# EAGLE design NE555SingleTimer (EAGLE 9.6.2)
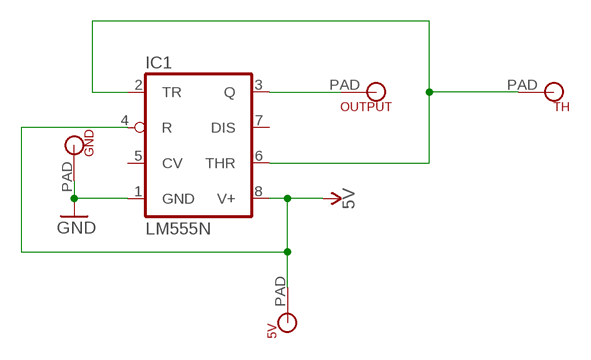
[diagram p0: schematic, sheet 1]

## Parts
5V  MICROBIT_PAD  [MICROBIT_PAD]
GND  MICROBIT_PAD  [MICROBIT_PAD]
IC1  LM555N  [DIL08]
OUTPUT  MICROBIT_PAD  [MICROBIT_PAD]
TH  MICROBIT_PAD  [MICROBIT_PAD]

## Nets
5V: 5V.PAD IC1.4(R) IC1.8(V+)
GND: GND.PAD IC1.1(GND)
N$1: IC1.3(Q) OUTPUT.PAD
N$2: IC1.2(TR) IC1.6(THR) TH.PAD
Unconnected: IC1.5(CV) IC1.7(DIS)

## Library data of the parts
5V GND OUTPUT TH = microbit:MICROBIT_PAD
IC1 = linear:*555: TIMER

## Board
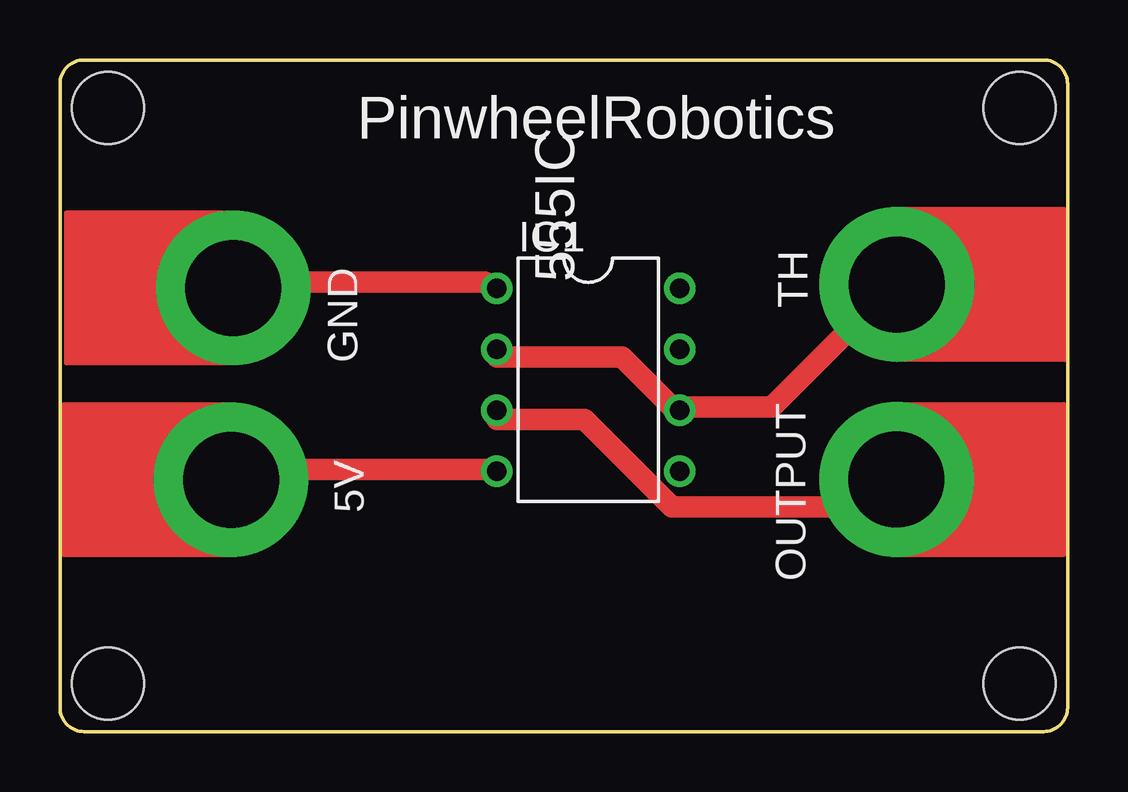
[diagram p1: board, top side]
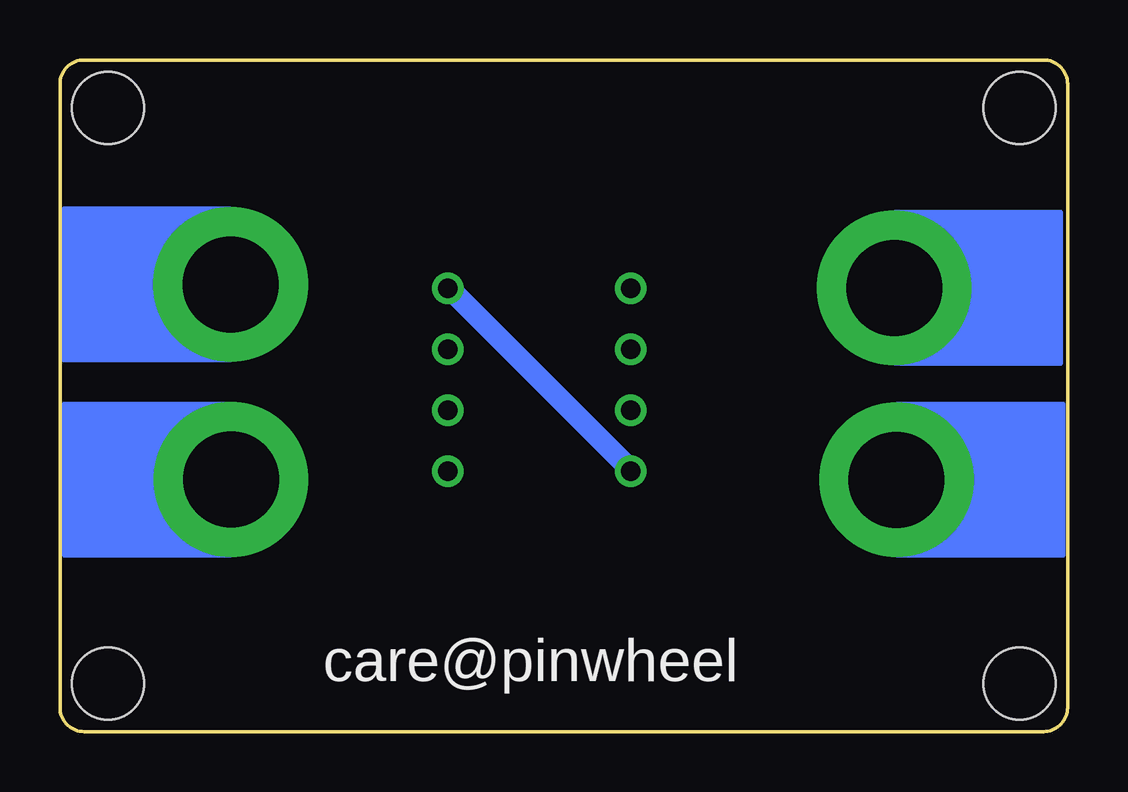
[diagram p2: board, bottom side, seen from below]

Size 42 x 28 mm. Coordinates in mm from the lower left corner, seen from the top.
Outline: 0,27 0,1 arc90 1,0 41,0 arc90 42,1 42,27 arc90 41,28 1,28 arc90 0,27
Copper layers (1*16): Top 0.035mm / dielectric 1.5mm / Bottom 0.035mm
Design rules "default *": minimum track width 35mil, minimum drill 0.35mm, track to track 6mil, track to pad 6mil, pad to pad 6mil, via to via 6mil, smd to smd 6mil, copper to edge 40mil, drill to drill 6mil, minimum pad ring 10mil, minimum via ring 8mil, stop-mask expansion 4mil, vias tented up to drill 0mil, thermal gap 10mil
Holes 3 mm at 2,26 40,26 40,2 2,2

### Footprints (pad centres in the part's own frame; a part is rotated, then mirrored left to right if it is on the bottom)
MICROBIT_PAD = drill 4 pad 6.452: PAD 0,0
DIL08 = drill 0.813 pad 1.27: 1 -3.81,-3.81; 2 -1.27,-3.81; 3 1.27,-3.81; 4 3.81,-3.81; 5 3.81,3.81; 6 1.27,3.81; 7 -1.27,3.81; 8 -3.81,3.81

### Placement (x,y rotation side)
5V  7.13,10.5 270 top
GND  7.23,18.5 270 top
IC1  22.02,14.66 270 top
OUTPUT  34.87,10.51 90 top
TH  34.88,18.64 90 top

### Tracks (layer width: path | path; a pad name or v marks a point on that pad's centre or on a via)
5V
  Top 0.889: IC1.4 17.7,10.94 7.29,10.94 5V.PAD
  Bottom 0.889: IC1.8 25.51,18.22 18.22,10.94 IC1.4
GND
  Top 0.889: IC1.1 17.7,18.75 7.29,18.75 GND.PAD
N$1
  Top 0.889: IC1.3 18.22,13.02 21.87,13.02 25.51,9.37 33.33,9.37 34.37,10.41 OUTPUT.PAD
N$2
  Top 0.889: IC1.2 18.22,15.62 23.43,15.62 25.51,13.54 IC1.6 26.04,13.54 29.68,13.54 34.37,18.22 TH.PAD

### Text on the board
tPlace: PinwheelRobotics | 555IC
bPlace: care@pinwheel